# EAGLE design Polarshield v2.0c (EAGLE 6.5.0)
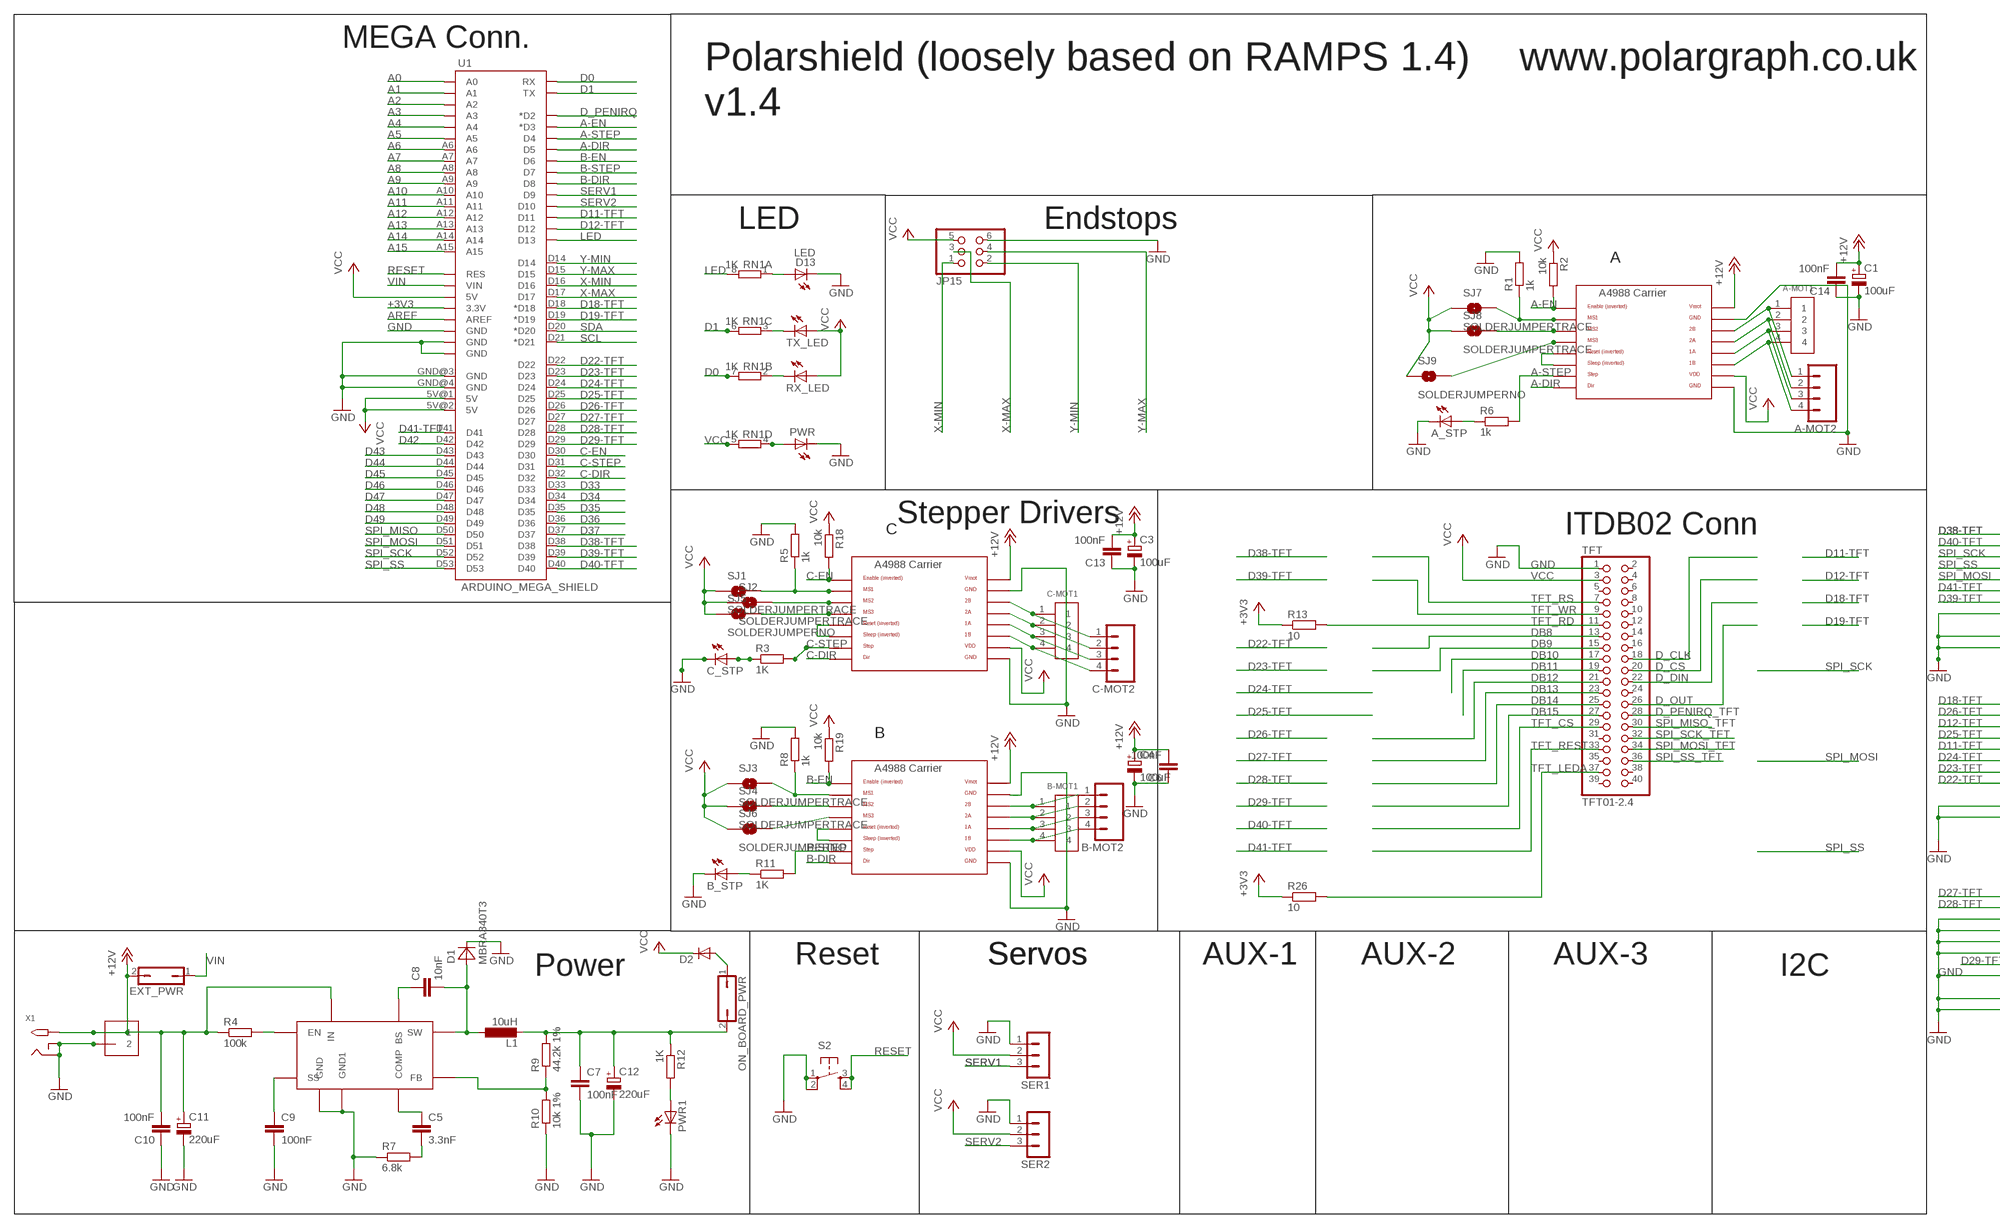
[diagram p0: schematic, sheet 1, part 1 of 2]
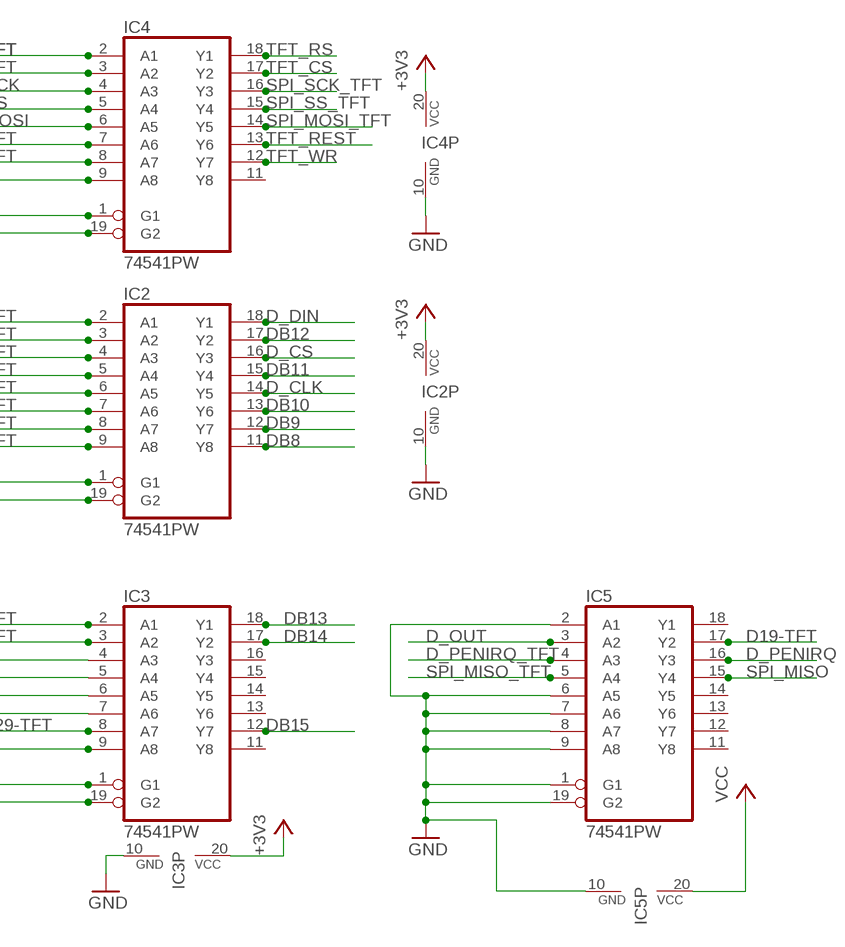
[diagram p1: schematic, sheet 1, part 2 of 2]

## Parts
A-MOT1  1X4-BIG  [1X04-BIG]
A-MOT2  M04SCREW  [SCREWTERMINAL-3.5MM-4]
A_STP  LEDCHIP-LED0805  [CHIP-LED0805]
B-MOT1  1X4-BIG  [1X04-BIG]
B-MOT2  M04SCREW  [SCREWTERMINAL-3.5MM-4]
B_STP  LEDCHIP-LED0805  [CHIP-LED0805]
C1  100uF  CPOL-EU153CLV-0605  [153CLV-0605]
C3  100uF  CPOL-EU153CLV-0605  [153CLV-0605]
C4  100uF  CPOL-EU153CLV-0605  [153CLV-0605]
C5  3.3nF  C-EUC0805K  [C0805K]
C6  100nF  C-EUC0805  [C0805]
C7  100nF  C-EUC0805K  [C0805K]
C8  10nF  C-EUC0805K  [C0805K]
C9  100nF  C-EUC0805K  [C0805K]
C10  100nF  C-EUC0805K  [C0805K]
C11  220uF  CPOL-EU153CLV-0807  [153CLV-0807]
C12  220uF  CPOL-EU153CLV-0807  [153CLV-0807]
C13  100nF  C-EUC0805  [C0805]
C14  100nF  C-EUC0805  [C0805]
C-MOT1  1X4-BIG  [1X04-BIG]
C-MOT2  M04SCREW  [SCREWTERMINAL-3.5MM-4]
C_STP  LEDCHIP-LED0805  [CHIP-LED0805]
D1  MBRA340T3  [SMA]
D2  DIODE-DO214BA  [DO214BA]
D13  LED  LEDCHIP-LED0805  [CHIP-LED0805]
EXT_PWR  JP1Q  [JP1]
IC1  MP2307  [SOIC8]
IC2  74541PW  [TSSOP20]
IC3  74541PW  [TSSOP20]
IC4  74541PW  [TSSOP20]
IC5  74541PW  [TSSOP20]
J1  1X2-3.5MM  [1X2-3.5MM]
JP15  PINHD-2X3  [2X03]
L1  10uH  L-EUPIS2816  [PIS2816]
ON_BOARD_PWR  JP1Q  [JP1]
PWR  LEDCHIP-LED0805  [CHIP-LED0805]
PWR1  LEDCHIP-LED0805  [CHIP-LED0805]
R1  1k  R-EU_R0805  [R0805]
R2  10k  R-EU_R0805  [R0805]
R3  1K  R-EU_R0805  [R0805]
R4  100k  R-EU_R0805  [R0805]
R5  1k  R-EU_R0805  [R0805]
R6  1k  R-EU_R0805  [R0805]
R7  6.8k  R-EU_R0805  [R0805]
R8  1k  R-EU_R0805  [R0805]
R9  44.2k 1%  R-EU_R0805  [R0805]
R10  10k 1%  R-EU_R0805  [R0805]
R11  1K  R-EU_R0805  [R0805]
R12  1K  R-EU_R0805  [R0805]
R13  10  R-EU_R0805  [R0805]
R18  10k  R-EU_R0805  [R0805]
R19  10k  R-EU_R0805  [R0805]
R26  10  R-EU_R0805  [R0805]
RN1  1K  4R-NEXBS8V  [EXBS8V]
RX_LED  LEDCHIP-LED0805  [CHIP-LED0805]
S2  TAC_SWITCHPTH  [TACTILE-PTH]
SER1  3PIN-HEADER  [3PIN-HEADER]
SER2  3PIN-HEADER  [3PIN-HEADER]
SJ1  SOLDERJUMPERTRACE  [SJ_2S-TRACE]
SJ2  SOLDERJUMPERTRACE  [SJ_2S-TRACE]
SJ3  SOLDERJUMPERTRACE  [SJ_2S-TRACE]
SJ4  SOLDERJUMPERTRACE  [SJ_2S-TRACE]
SJ5  SOLDERJUMPERNO  [SJ_2S-NO]
SJ6  SOLDERJUMPERNO  [SJ_2S-NO]
SJ7  SOLDERJUMPERTRACE  [SJ_2S-TRACE]
SJ8  SOLDERJUMPERTRACE  [SJ_2S-TRACE]
SJ9  SOLDERJUMPERNO  [SJ_2S-NO]
TFT  TFT01-2.4  [TFT01-2.4]
TX_LED  LEDCHIP-LED0805  [CHIP-LED0805]
U1  ARDUINO_MEGA_SHIELD  [ARDUINO_MEGA_SHIELD]
U$1  A4988BREAKOUT  [A4988BREAKOUT]
U$6  A4988BREAKOUT  [A4988BREAKOUT]
U$7  A4988BREAKOUT  [A4988BREAKOUT]
X1  2.1MMJACKTHM  [PJ-102A]

## Nets
+3V3: IC2.20(VCC) IC3.20(VCC) IC4.20(VCC) R13.1 R26.1 U1.3.3V
+12V [vmot]: C1.+ C3.+ C4.+ C6.2 C10.2 C11.+ C13.2 C14.2 EXT_PWR.2 IC1.IN J1.1 R4.1 U$1.VMOT U$6.VMOT U$7.VMOT X1.TIP
A0: U1.A0
A1: U1.A1
A2: U1.A2
A3: U1.A3
A4: U1.A4
A5: U1.A5
A6: U1.A6
A7: U1.A7
A8: U1.A8
A9: U1.A9
A10: U1.A10
A11: U1.A11
A12: U1.A12
A13: U1.A13
A14: U1.A14
A15: U1.A15
A-DIR: U1.D5 U$1.DIR
A-EN: R2.2 U1.D3(*D3) U$1.EN
A-STEP: R6.2 U1.D4 U$1.STEP
AREF: U1.AREF
B-DIR: U1.D8 U$7.DIR
B-EN: R19.2 U1.D6 U$7.EN
B-STEP: R11.2 U1.D7 U$7.STEP
C-DIR: U1.D32 U$6.DIR
C-EN: R18.2 U1.D30 U$6.EN
C-STEP: R3.2 U1.D31 U$6.STEP
D0: RN1.7 U1.RX
D1: RN1.6 U1.TX
D11-TFT: IC2.6(A5) U1.D11
D12-TFT: IC2.4(A3) U1.D12
D18-TFT: IC2.2(A1) U1.D18(*D18)
D19-TFT [signal]: IC5.17(Y2) U1.D19(*D19)
D22-TFT: IC2.9(A8) U1.D22
D23-TFT: IC2.8(A7) U1.D23
D24-TFT: IC2.7(A6) U1.D24
D25-TFT: IC2.5(A4) U1.D25
D26-TFT: IC2.3(A2) U1.D26
D27-TFT: IC3.2(A1) U1.D27
D28-TFT: IC3.3(A2) U1.D28
D29-TFT: IC3.8(A7) U1.D29
D33: U1.D33
D34: U1.D34
D35: U1.D35
D36: U1.D36
D37: U1.D37
D38-TFT: IC4.2(A1) U1.D38
D39-TFT: IC4.8(A7) U1.D39
D40-TFT: IC4.3(A2) U1.D40
D41-TFT: IC4.7(A6) U1.D41
D42: U1.D42
D43: U1.D43
D44: U1.D44
D45: U1.D45
D46: U1.D46
D47: U1.D47
D48: U1.D48
D49: U1.D49
D_CLK: IC2.14(Y5) TFT.18
D_CS: IC2.16(Y3) TFT.20
D_DIN: IC2.18(Y1) TFT.22
D_OUT: IC5.3(A2) TFT.26
D_PENIRQ: IC5.16(Y3) U1.D2(*D2)
D_PENIRQ_TFT: IC5.4(A3) TFT.28
DB8: IC2.11(Y8) TFT.13
DB9: IC2.12(Y7) TFT.15
DB10: IC2.13(Y6) TFT.17
DB11: IC2.15(Y4) TFT.19
DB12: IC2.17(Y2) TFT.21
DB13: IC3.18(Y1) TFT.23
DB14: IC3.17(Y2) TFT.25
DB15: IC3.12(Y7) TFT.27
GND [gnd5]: A_STP.C B_STP.C C1.- C3.- C4.- C6.1 C7.2 C9.2 C10.1 C11.- C12.- C13.1 C14.1 C_STP.C D1.C D13.C IC1.GND IC1.GND1 IC2.1(G1) IC2.10(GND) IC2.19(G2) IC3.1(G1) IC3.4(A3) IC3.5(A4) IC3.6(A5) IC3.7(A6) IC3.9(A8) IC3.10(GND) IC3.19(G2) IC4.1(G1) IC4.9(A8) IC4.10(GND) IC4.19(G2) IC5.1(G1) IC5.2(A1) IC5.6(A5) IC5.7(A6) IC5.8(A7) IC5.9(A8) IC5.10(GND) IC5.19(G2) J1.2 JP15.6 PWR1.C PWR.C R1.2 R5.2 R7.1 R8.2 R10.1 S2.1 S2.2 SER1.1 SER2.1 TFT.1 U1.GND@0(GND) U1.GND@1(GND) U1.GND@2(GND) U1.GND@3(GND) U1.GND@4(GND) U$1.GND U$1.GND@0(GND) U$6.GND U$6.GND@0(GND) U$7.GND U$7.GND@0(GND) X1.RING X1.RING_SW
LED: RN1.8 U1.D13
N$1: U$6.RST U$6.SLP(SLEEP)
N$2: PWR.A RN1.4
N$3: R5.1 SJ1.2 U$6.MS1
N$4: A-MOT1.1 A-MOT2.1 U$1.2B
N$5 [vmot]: A-MOT1.2 A-MOT2.2 U$1.2A
N$6 [vmot]: A-MOT1.3 A-MOT2.3 U$1.1A
N$7: A-MOT1.4 A-MOT2.4 U$1.1B
N$8: U$1.RST U$1.SLP(SLEEP)
N$9: R1.1 SJ7.2 U$1.MS1
N$10: SJ2.2 U$6.MS2
N$11: SJ8.2 U$1.MS2
N$12: SJ5.2 U$6.MS3
N$13: U$7.RST U$7.SLP(SLEEP)
N$14: SJ9.2 U$1.MS3
N$15: RN1.2 RX_LED.C
N$16: RN1.3 TX_LED.C
N$17: SJ4.2 U$7.MS2
N$18: B_STP.A R11.1
N$19: A_STP.A R6.1
N$20: D13.A RN1.1
N$21: C-MOT1.1 C-MOT2.1 U$6.2B
N$22: C-MOT1.2 C-MOT2.2 U$6.2A
N$23: C_STP.A R3.1
N$24: C7.1 C12.+ L1.2 ON_BOARD_PWR.2 R9.2 R12.1
N$25: PWR1.A R12.2
N$26: C-MOT1.3 C-MOT2.3 U$6.1A
N$27: C-MOT1.4 C-MOT2.4 U$6.1B
N$28: B-MOT1.1 B-MOT2.1 U$7.2B
N$29: B-MOT1.2 B-MOT2.2 U$7.2A
N$30: B-MOT1.3 B-MOT2.3 U$7.1A
N$31: SJ6.2 U$7.MS3
N$32: IC1.FB R9.1 R10.2
N$33: R8.1 SJ3.2 U$7.MS1
N$34: IC1.EN R4.2
N$36: B-MOT1.4 B-MOT2.4 U$7.1B
N$37: D2.A ON_BOARD_PWR.1
N$38: C9.1 IC1.SS
N$40: C5.2 R7.2
N$42: C5.1 IC1.COMP
N$43: C8.1 IC1.BS
N$44: C8.2 D1.A IC1.SW L1.1
RESET: S2.3 S2.4 U1.RES
SCL: U1.D21(*D21)
SDA: U1.D20(*D20)
SERV1: SER1.3 U1.D9
SERV2: SER2.3 U1.D10
SPI_MISO: IC5.15(Y4) U1.D50
SPI_MISO_TFT: IC5.5(A4) TFT.30
SPI_MOSI: IC4.6(A5) U1.D51
SPI_MOSI_TFT: IC4.14(Y5) TFT.34
SPI_SCK: IC4.4(A3) U1.D52
SPI_SCK_TFT: IC4.16(Y3) TFT.32
SPI_SS: IC4.5(A4) U1.D53
SPI_SS_TFT: IC4.15(Y4) TFT.36
TFT_CS: IC4.17(Y2) TFT.29
TFT_LEDA: R26.2 TFT.37
TFT_RD: R13.2 TFT.11
TFT_REST: IC4.13(Y6) TFT.33
TFT_RS: IC4.18(Y1) TFT.7
TFT_WR: IC4.12(Y7) TFT.9
VCC: D2.C IC5.20(VCC) JP15.5 R2.1 R18.1 R19.1 RN1.5 RX_LED.A SER1.2 SER2.2 SJ1.1 SJ2.1 SJ3.1 SJ4.1 SJ5.1 SJ6.1 SJ7.1 SJ8.1 SJ9.1 TFT.3 TX_LED.A U1.5V@0(5V) U1.5V@1(5V) U1.5V@2(5V) U$1.VDD U$6.VDD U$7.VDD
VIN [vcc]: EXT_PWR.1 U1.VIN
X-MAX: JP15.3 U1.D17
X-MIN: JP15.1 U1.D16
Y-MAX: JP15.4 U1.D15
Y-MIN: JP15.2 U1.D14
Unconnected: IC3.11(Y8) IC3.13(Y6) IC3.14(Y5) IC3.15(Y4) IC3.16(Y3) IC4.11(Y8) IC5.11(Y8) IC5.12(Y7) IC5.13(Y6) IC5.14(Y5) IC5.18(Y1) TFT.2 TFT.4 TFT.5 TFT.6 TFT.8 TFT.10 TFT.12 TFT.14 TFT.16 TFT.24 TFT.31 TFT.35 TFT.38 TFT.39 TFT.40

## Notes on the sheet
- MEGA Conn.
- Polarshield (loosely based on RAMPS 1.4) | www.polargraph.co.uk
- v1.4
- LED | Endstops
- A
- Stepper Drivers
- C | ITDB02 Conn
- B
- Reset | Servos | Servos | AUX-1 | AUX-2 | AUX-3
- Power | I2C

## Library data of the parts
A-MOT1 B-MOT1 C-MOT1 = adafruit:1X4: 4-pin connector
A-MOT2 B-MOT2 C-MOT2 = SparkFun:M04: Header 4 Standard 4-pin 0.1" header. Use with straight break away headers (SKU : PRT-00116), right angle break away headers (PRT-00553), swiss pins (PRT-00743), machine pins (PRT-00117), and female headers (PRT-00115). Molex polarized connector foot print use with SKU : PRT-08231 with associated crimp pins and housings. 1MM SMD Version SKU: PRT-10208
A_STP B_STP C_STP D13 PWR PWR1 RX_LED TX_LED = led:LED: LED OSRAM: - CHIPLED LG R971, LG N971, LY N971, LG Q971, LY Q971, LO R971, LY R971 LH N974, LH R974 LS Q976, LO Q976, LY Q976 LO Q996 - Hyper CHIPLED LW Q18S LB Q993, LB Q99A, LB R99A - SideLED LS A670, LO A670, LY A670, LG A670, LP A670 LB A673, LV A673, LT A673, LW A673 LH A674 LY A675 LS A676, LA A676, LO A676, LY A676, LW A676 LS A679, LY A679, LG A679 - Hyper Micro SIDELED® LS Y876, LA Y876, LO Y876, LY Y876 LT Y87S - SmartLED LW L88C, LW L88S LB L89C, LB L89S, LG L890 LS L89K, LO L89K, LY L89K LS L896, LA L896, LO L896, LY L896 - TOPLED LS T670, LO T670, LY T670, LG T670, LP T670 LSG T670, LSP T670, LSY T670, LOP T670, LYG T670 LG T671, LOG T671, LSG T671 LB T673, LV T673, LT T673, LW T673 LH T674 LS T676, LA T676, LO T676, LY T676, LB T676, LH T676, LSB T676, LW T676 LB T67C, LV T67C, LT T67C, LS T67K, LO T67K, LY T67K, LW E67C LS E67B, LA E67B, LO E67B, LY E67B, LB E67C, LV E67C, LT E67C LW T67C LS T679, LY T679, LG T679 LS T770, LO T770, LY T770, LG T770, LP T770 LB T773, LV T773, LT T773, LW T773 LH T774 LS E675, LA E675, LY E675, LS T675 LS T776, LA T776, LO T776, LY T776, LB T776 LHGB T686 LT T68C, LB T68C - Hyper Mini TOPLED® LB M676 - Mini TOPLED Santana® LG M470 LS M47K, LO M47K, LY M47K Source: http://www.osram.convergy.de LUXEON: - LUMILED® LXK2-PW12-R00, LXK2-PW12-S00, LXK2-PW14-U00, LXK2-PW14-V00 LXK2-PM12-R00, LXK2-PM12-S00, LXK2-PM14-U00 LXK2-PE12-Q00, LXK2-PE12-R00, LXK2-PE12-S00, LXK2-PE14-T00, LXK2-PE14-U00 LXK2-PB12-K00, LXK2-PB12-L00, LXK2-PB12-M00, LXK2-PB14-N00, LXK2-PB14-P00, LXK2-PB14-Q00 LXK2-PR12-L00, LXK2-PR12-M00, LXK2-PR14-Q00, LXK2-PR14-R00 LXK2-PD12-Q00, LXK2-PD12-R00, LXK2-PD12-S00 LXK2-PH12-R00, LXK2-PH12-S00 LXK2-PL12-P00, LXK2-PL12-Q00, LXK2-PL12-R00 Source: www.luxeon.com KINGBRIGHT: KA-3528ASYC Source: www.kingbright.com
C1 C3 C4 = rcl:CPOL-EU: POLARIZED CAPACITOR, European symbol
C5-C10 C13 C14 = resistor:C-EU: CAPACITOR, European symbol
C11 C12 = resistor:CPOL-EU: POLARIZED CAPACITOR, European symbol
D1 = diode:MBRA340T3: Surface Mount Schottky Power Rectifier Source: http://www.onsemi.com/pub_link/Collateral/MBRA340T3-D.PDF
D2 = diode:DIODE-: DIODE
EXT_PWR ON_BOARD_PWR = jumper:JP1Q: JUMPER
IC1 = sandy:MP2307
IC2-IC5 = 74xx-eu:74*541: Octal BUFFER and LINE DRIVER, 3-state
J1 = adafruit:1X2: 3.5mm Terminal block http://www.ladyada.net/library/pcb/eaglelibrary.html
JP15 = pinhead:PINHD-2X3: PIN HEADER
L1 = rcl:L-EU: INDUCTOR, European symbol
R1-R3 R5 R6 R8 R11 R12 R18 R19 = rcl:R-EU_: RESISTOR, European symbol
R4 R7 R9 R10 R13 R26 = resistor:R-EU_: RESISTOR, European symbol
RN1 = resistor-dil:4R-N: Array Chip Resistor Source: RS Component / Phycomp; OC_FARNELL: unknown; OC_NEWARK: unknown
S2 = SparkFun:TAC_SWITCH: Momentary Switch Button commonly used for reset or general input. Spark Fun Electronics SKU : COM-00097
SER1 SER2 = ultimachine:3PIN-HEADER: PIN HEADER
SJ1-SJ9 = SparkFun:SOLDERJUMPER: Solder Jumper Standard SMD solder jumper. Used to automate production. Two varients : Normally Open and Normally Closed are the same, but have different paste layers. NC will have a large amount of paste and should jumper during reflow.
TFT = sandy:TFT01-2.4
U1 = RepRapjr:ARDUINO_MEGA_SHIELD
U$1 U$6 U$7 = RepRapjr:A4988BREAKOUT
X1 = adafruit:2.1MMJACK: 2.1mm x 5.5mm THM DC jack with internal switch. Digikey part #PJ-102A, 4UCON part #05537 2.1mm x 5.5mm SMT DC jack with internal switch. Digikey part #PJ-002A-SMT, 4UCON part #03267 By microbuilder.eu & adafruit.com

## Net classes
0 default: width 0.406 mm
1 gnd12: width 1.422 mm
2 gnd5: width 1.422 mm
3 vmot: width 1.422 mm
4 vcc: width 0.61 mm
5 signal: width 0.406 mm

## Board
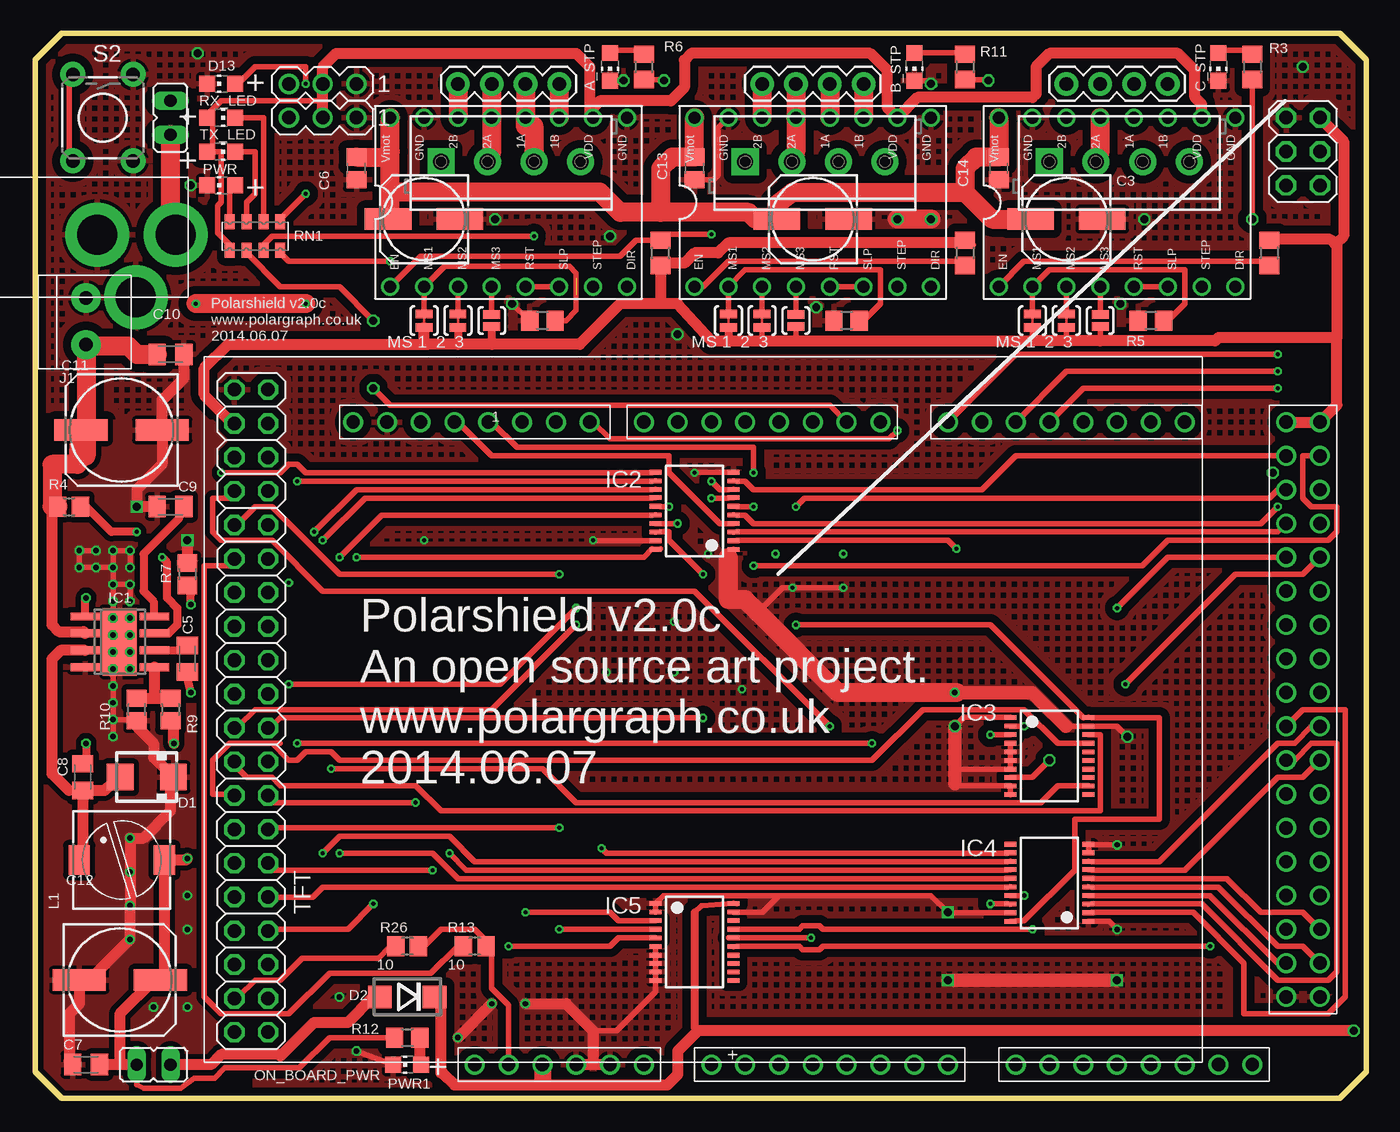
[diagram p2: board, top side]
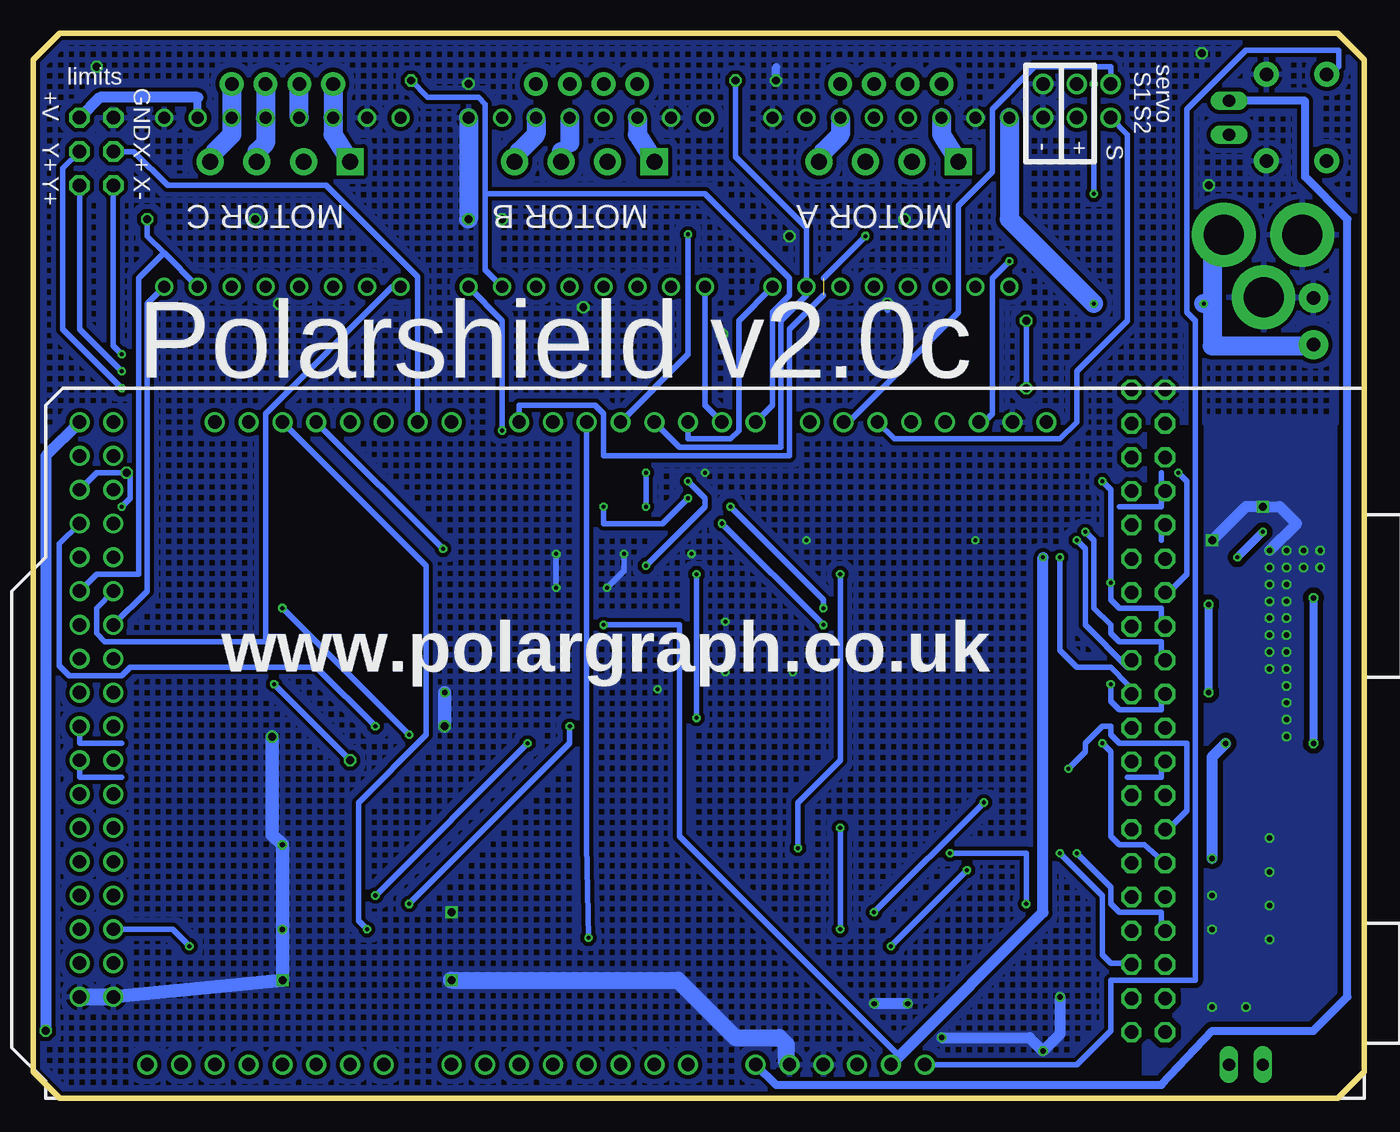
[diagram p3: board, bottom side, seen from below]

Size 100 x 80 mm. Coordinates in mm from the lower left corner, seen from the top.
Outline: 100,2 100,78 98,80 2,80 0,78 0,2 2,0 98,0 100,2
Copper layers (1*2*15*16): Top 0.035mm / dielectric 0.2mm / Route2 0.0175mm / dielectric 1.1mm / Route15 0.0175mm / dielectric 0.2mm / Bottom 0.035mm
Design rules "SeeedStudio_DRU_no_angle_20130527": minimum track width 6mil, minimum drill 12mil, track to track 6mil, track to pad 6mil, pad to pad 6mil, via to via 6mil, smd to smd 0mil, copper to edge 10mil, drill to drill 10mil, minimum pad ring 6mil, minimum via ring 6mil, stop-mask expansion 2mil, vias tented up to drill 25mil, thermal gap 10mil

### Footprints (pad centres in the part's own frame; a part is rotated, then mirrored left to right if it is on the bottom)
1X04-BIG = drill 1.016 pad 1.778: 1 0,0; 2 2.54,0; 3 5.08,0; 4 7.62,0
SCREWTERMINAL-3.5MM-4 = drill 1.2 pad 2.032 square: 1 0,0 | drill 1.2 pad 2.032: 2 3.5,0; 3 7,0; 4 10.5,0
CHIP-LED0805 = smd 1.2 x 1.2: A 0,-1.05; C 0,1.05
153CLV-0605 = smd 3.5 x 1.6: + 2.7,0; - -2.7,0
C0805K = smd 1.3 x 1.6: 1 -1,0; 2 1,0
C0805 = smd 1.3 x 1.5: 1 -0.85,0; 2 0.85,0
153CLV-0807 = smd 4 x 1.6: + 3.05,0; - -3.05,0
SMA = smd 2 x 2: A 2,0; C -2,0
DO214BA = smd 1.8 x 1.7: A 2.05,0; C -2.05,0
JP1 = drill 0.914 long: 1 0,-1.27; 2 0,1.27
SOIC8 = smd 0.6 x 2.2: BS -1.905,-2.6; COMP 0.635,2.6; EN -0.635,2.6; FB 1.905,2.6; GND 1.905,-2.6; IN -0.635,-2.6; SS -1.905,2.6; SW 0.635,-2.6 | smd 5.08 x 2.54: GND1 0,0
TSSOP20 = smd 0.35 x 0.9: 1 -1.95,-2.925; 2 -1.3,-2.925; 3 -0.65,-2.925; 4 0,-2.925; 5 0.65,-2.925; 6 1.3,-2.925; 7 1.95,-2.925; 8 2.555,-2.925; 9 3.205,-2.925; 10 3.855,-2.925; 11 3.855,2.925; 12 3.205,2.925; 13 2.555,2.925; 14 1.95,2.925; 15 1.3,2.925; 16 0.65,2.925; 17 0,2.925; 18 -0.65,2.925; 19 -1.3,2.925; 20 -1.95,2.925
1X2-3.5MM = drill 1 pad 2.184: 1 1.8,0; 2 -1.7,0
2X03 = drill 1.016 octagon: 1 -2.54,-1.27; 2 -2.54,1.27; 3 0,-1.27; 4 0,1.27; 5 2.54,-1.27; 6 2.54,1.27
PIS2816 = smd 2.2 x 1.6: 1 0,3.2; 2 0,-3.2
R0805 = smd 1.3 x 1.5: 1 -0.95,0; 2 0.95,0
R0805' = smd 1.3 x 1.5: 1 -0.85,0; 2 0.85,0
EXBS8V = smd 0.75 x 1.1: 1 -1.905,-1.07; 2 -0.635,-1.07; 3 0.635,-1.07; 4 1.905,-1.07; 5 1.905,1.07; 6 0.635,1.07; 7 -0.635,1.07; 8 -1.905,1.07
TACTILE-PTH = drill 1.016 pad 1.88: 1 -3.251,2.261; 2 3.251,2.261; 3 -3.251,-2.261; 4 3.251,-2.261
3PIN-HEADER = drill 1.016: 1 -2.54,0; 2 0,0; 3 2.54,0
SJ_2S-TRACE = smd 0.635 x 1.27: 1 -0.508,0; 2 0.508,0
SJ_2S-NO = smd 0.635 x 1.27: 1 -0.45,0; 2 0.45,0
TFT01-2.4 = drill 1.016 octagon: 1 0.98,24.02; 2 3.52,24.02; 3 0.98,21.48; 4 3.52,21.48; 5 0.98,18.94; 6 3.52,18.94; 7 0.98,16.4; 8 3.52,16.4; 9 0.98,13.86; 10 3.52,13.86; 11 0.98,11.32; 12 3.52,11.32; 13 0.98,8.78; 14 3.52,8.78; 15 0.98,6.24; 16 3.52,6.24; 17 0.98,3.7; 18 3.52,3.7; 19 0.98,1.16; 20 3.52,1.16; 21 0.98,-1.38; 22 3.52,-1.38; 23 0.98,-3.92; 24 3.52,-3.92; 25 0.98,-6.46; 26 3.52,-6.46; 27 0.98,-9; 28 3.52,-9; 29 0.98,-11.54; 30 3.52,-11.54; 31 0.98,-14.08; 32 3.52,-14.08; 33 0.98,-16.62; 34 3.52,-16.62; 35 0.98,-19.16; 36 3.52,-19.16; 37 0.98,-21.7; 38 3.52,-21.7; 39 0.98,-24.24; 40 3.52,-24.24
ARDUINO_MEGA_SHIELD = drill 1 pad 1.422: 3.3V 50.8,26.67; 5V@0 50.8,29.21; 5V@1 2.54,85.09; 5V@2 2.54,87.63; A0 50.8,41.91; A1 50.8,44.45; A2 50.8,46.99; A3 50.8,49.53; A4 50.8,52.07; A5 50.8,54.61; A6 50.8,57.15; A7 50.8,59.69; A8 50.8,64.77; A9 50.8,67.31; A10 50.8,69.85; A11 50.8,72.39; A12 50.8,74.93; A13 50.8,77.47; A14 50.8,80.01; A15 50.8,82.55; AREF 2.54,14.986; D2 2.54,49.53; D3 2.54,46.99; D4 2.54,44.45; D5 2.54,41.91; D6 2.54,39.37; D7 2.54,36.83; D8 2.54,32.766; D9 2.54,30.226; D10 2.54,27.686; D11 2.54,25.146; D12 2.54,22.606; D13 2.54,20.066; D14 2.54,59.69; D15 2.54,62.23; D16 2.54,64.77; D17 2.54,67.31; D18 2.54,69.85; D19 2.54,72.39; D20 2.54,74.93; D21 2.54,77.47; D22 5.08,85.09; D23 5.08,87.63; D24 7.62,85.09; D25 7.62,87.63; D26 10.16,85.09; D27 10.16,87.63; D28 12.7,85.09; D29 12.7,87.63; D30 15.24,85.09; D31 15.24,87.63; D32 17.78,85.09; D33 17.78,87.63; D34 20.32,85.09; D35 20.32,87.63; D36 22.86,85.09; D37 22.86,87.63; D38 25.4,85.09; D39 25.4,87.63; D40 27.94,85.09; D41 27.94,87.63; D42 30.48,85.09; D43 30.48,87.63; D44 33.02,85.09; D45 33.02,87.63; D46 35.56,85.09; D47 35.56,87.63; D48 38.1,85.09; D49 38.1,87.63; D50 40.64,85.09; D51 40.64,87.63; D52 43.18,85.09; D53 43.18,87.63; GND@0 50.8,31.75; GND@1 50.8,34.29; GND@2 2.54,17.526; GND@3 45.72,85.09; GND@4 45.72,87.63; RES 50.8,24.13; RX 2.54,54.61; TX 2.54,52.07; VIN 50.8,36.83
A4988BREAKOUT = drill 0.9: 1A 8.89,1.27; 1B 11.43,1.27; 2A 6.35,1.27; 2B 3.81,1.27; DIR 16.51,-11.43; EN -1.27,-11.43; GND 16.51,1.27; GND@0 1.27,1.27; MS1 1.27,-11.43; MS2 3.81,-11.43; MS3 6.35,-11.43; RST 8.89,-11.43; SLP 11.43,-11.43; STEP 13.97,-11.43; VDD 13.97,1.27; VMOT -1.27,1.27
PJ-102A = drill 3 pad 4.8: RING 0.1,-3.39; RING_SW -4.6,-6.29; TIP 0.1,-9.29

### Placement (x,y rotation side)
A-MOT1  31.75,76.2 0 top
A-MOT2  30.48,70.36 0 top
A_STP  43.18,77.47 180 top
B-MOT1  54.61,76.2 0 top
B-MOT2  53.34,70.36 0 top
B_STP  66.04,77.47 180 top
C1  29.21,66.04 180 top
C3  77.47,66.04 180 top
C4  58.42,66.04 180 top
C5  11.43,33.02 270 top
C6  24.13,69.85 90 top
C7  3.81,2.54 180 top
C8  3.56,24.13 270 top
C9  10.16,44.45 180 top
C10  10.16,55.88 180 top
C11  6.48,50.2 180 top
C12  6.35,8.89 0 top
C13  49.53,69.85 90 top
C14  72.39,69.85 90 top
C-MOT1  77.47,76.2 0 top
C-MOT2  76.2,70.36 0 top
C_STP  88.9,77.47 180 top
D1  8.38,24.13 180 top
D2  27.94,7.62 180 top
D13  13.97,76.2 90 top
EXT_PWR  10.16,73.66 180 top
IC1  6.35,34.29 270 top
IC2  49.53,43.18 90 top
IC3  76.2,26.67 270 top
IC4  76.2,15.24 90 top
IC5  49.53,12.7 270 top
J1  3.81,58.42 270 top
JP15  95.25,71.12 90 top
L1  6.5,17.91 90 top
ON_BOARD_PWR  8.89,2.54 90 top
PWR  13.97,68.58 90 top
PWR1  27.94,2.54 90 top
R1  38.1,58.42 180 top
R2  46.99,63.5 90 top
R3  91.44,77.47 270 top
R4  100k  [R0805']  2.54,44.45 0 top
R5  83.82,58.42 180 top
R6  45.72,77.47 270 top
R7  6.8k  [R0805']  11.43,39.37 270 top
R8  60.96,58.42 180 top
R9  44.2k 1%  [R0805']  10.16,29.21 270 top
R10  10k 1%  [R0805']  7.62,29.21 90 top
R11  69.85,77.47 270 top
R12  27.94,4.57 0 top
R13  10  [R0805']  33.02,11.43 180 top
R18  92.71,63.5 270 top
R19  69.85,63.5 270 top
R26  10  [R0805']  27.94,11.43 180 top
RN1  16.51,64.77 180 top
RX_LED  13.97,73.66 270 top
S2  5.08,73.66 270 top
SER1  21.59,76.2 180 top
SER2  21.59,73.66 180 top
SJ1  74.93,58.42 90 top
SJ2  77.47,58.42 90 top
SJ3  52.07,58.42 90 top
SJ4  54.61,58.42 90 top
SJ5  80.01,58.42 90 top
SJ6  57.15,58.42 90 top
SJ7  29.21,58.42 90 top
SJ8  31.75,58.42 90 top
SJ9  34.29,58.42 90 top
TFT  13.97,29.21 0 top
TX_LED  13.97,71.12 270 top
U1  8.89,53.34 270 top
U$1  27.94,72.39 0 top
U$6  73.66,72.39 0 top
U$7  50.8,72.39 0 top
X1  1.27,64.77 90 top

### Tracks (layer width: path | path; a pad name or v marks a point on that pad's centre or on a via)
+3V3  (via drill 0.3)
  Top 0.406: IC4.20 73.66,13.34 74.3,13.34 78.11,17.14 78.11,20.95 84.45,20.95 84.45,28.57 79.38,28.57 IC3.20 78.74,28.57 71.75,35.56 v57.15,35.56 | 34.29,11.43 33.02,12.7 30.48,12.7 29.21,11.43 R26.1 | 46.99,41.27 IC2.20 46.35,41.27 45.72,40.64 v24.13,40.64 | 34.29,11.43 34.29,8.26 35.56,6.99 U1.3.3V | 34.29,11.43 R13.1
  Bottom 0.406: v57.15,35.56 51.44,35.56 51.44,19.68 34.92,3.17
  Bottom 0.813: v24.13,40.64 24.13,13.97 34.92,3.17 U1.3.3V
+12V  (via drill 0.3)
  Top 0.813: IC1.IN 3.62,35.05 1.78,35.05 1.27,35.56 1.27,44.03 R4.1
  Top 1.422: R4.1 1.27,44.45 1.27,47.62 3.17,47.62 C11.+ 3.81,48.26 J1.1 3.81,56.52 6.99,56.52 7.62,55.88 C10.2 | EXT_PWR.2 10.16,65.41 X1.TIP | 26.67,68.07 26.67,66.04 C1.+ | 26.67,68.07 26.67,71.12 | 26.67,71.12 U$1.VMOT | 46.99,66.55 53.59,66.55 54.1,66.04 C4.+ 55.72,67.15 56.9,68.07 69.85,68.07 | 46.99,66.55 43.94,66.55 42.42,68.07 26.67,68.07 | v20.32,59.69 v12.06,59.69 | C6.2 26.25,70.7 26.67,71.12 | U$7.VMOT C13.2 47.84,70.7 46.99,69.85 46.99,66.55 | U$6.VMOT C14.2 70.7,70.7 69.85,69.85 69.85,68.07 | 69.85,68.07 71.88,66.04 C3.+
  Bottom 1.422: 11.43,59.69 11.43,64.14 10.79,64.77 X1.TIP | 11.43,59.69 11.43,56.52 3.81,56.52 J1.1 | v20.32,59.69 26.67,66.04 U$1.VMOT | v12.06,59.69 11.43,59.69
A-DIR
  Bottom 0.406: U$1.DIR 46.99,58.42 46.99,50.16 47.62,49.53 50.8,49.53 U1.D5
A-EN  (via drill 0.3)
  Top 0.406: U$1.EN 28.96,63.25 43.94,63.25 45.15,64.45 R2.2 47.44,64.9 v50.8,64.9
  Bottom 0.406: U1.D3 50.8,55.88 v50.8,64.9
A-STEP  (via drill 0.6)
  Top 0.406: R6.2 47.18,76.52 v47.24,76.45
  Bottom 0.406: U1.D4 51.44,48.9 43.81,48.9 43.81,58.42 41.91,60.33 U$1.STEP 41.91,65.41 47.24,70.74 v47.24,76.45
B-DIR  (via drill 0.3)
  Top 0.406: v64.77,50.16 64.14,49.53 43.18,49.53 41.91,50.8 U1.D8
  Bottom 0.406: U$7.DIR 64.77,58.42 v64.77,50.16
B-EN
  Top 0.406: U$7.EN 50.16,60.96 52.07,62.87 69.85,62.87 R19.2
  Bottom 0.406: U1.D6 49.53,52.07 U$7.EN
B-STEP  (via drill 0.6)
  Top 0.406: R11.2 71.56,76.52 v71.63,76.45
  Bottom 0.406: 66.04,67.94 66.04,62.23 U$7.STEP | 66.04,67.94 66.04,74.68 66.55,75.18 70.36,75.18 v71.63,76.45 | U1.D7 44.45,52.07 44.45,59.05 43.18,60.33 43.18,61.59 49.53,67.94 66.04,67.94
C-DIR
  Bottom 0.406: U$6.DIR 91.44,59.69 91.44,38.1 U1.D32
C-EN
  Top 0.406: U$6.EN 74.3,62.87 92.71,62.87 R18.2
  Bottom 0.406: U1.D30 95.25,36.83 95.25,34.92 94.61,34.29 82.55,34.29 82.55,51.44 73.03,60.96 U$6.EN
C-STEP  (via drill 0.6)
  Top 0.406: v91.44,66.04 R3.2
  Bottom 0.406: U$6.STEP 90.17,63.5 | 90.17,63.5 91.44,64.77 v91.44,66.04 | U1.D31 95.25,39.37 92.08,39.37 92.08,61.59 90.17,63.5
D0  (via drill 0.3)  (1 unrouted)
  Top 0.406: v37.47,64.77 17.78,64.77 17.14,64.14 RN1.7
  Bottom 0.406: 40.64,61.59 v37.47,64.77 | 40.64,60.33 43.18,57.78 43.18,48.26 57.15,48.26 57.15,51.44 57.78,52.07 63.5,52.07 U1.RX
D1  (via drill 0.6)
  Top 0.406: U1.TX 59.69,52.07 26.67,52.07 v25.4,53.34 | RN1.6 15.88,63.5 18.41,60.96 22.86,60.96 v25.4,58.42
  Bottom 0.406: v25.4,53.34 v25.4,58.42
D11-TFT  (via drill 0.3)
  Top 0.406: U1.D11 34.29,50.8 36.2,48.9 53.98,48.9 v53.98,46.99 | v53.98,44.45 52.7,44.45 IC2.6
  Bottom 0.406: v53.98,46.99 v53.98,44.45
D12-TFT
  Top 0.406: IC2.4 51.44,43.18 47.62,46.99 47.62,48.26 34.29,48.26 31.75,50.8 U1.D12
D18-TFT  (via drill 0.3)
  Top 0.406: v69.22,41.27 68.58,41.91 52.7,41.91 IC2.2
  Bottom 0.406: v69.22,41.27 U1.D18
D19-TFT  (via drill 0.3)
  Top 0.406: v74.93,12.7 59.18,12.7 58.93,12.95 57.66,12.95 57.4,12.7 IC5.17
  Bottom 0.406: v74.93,12.7 75.56,13.34 75.56,22.23 70.48,27.3 70.48,40.01 U1.D19
D22-TFT
  Top 0.406: U1.D22 73.66,48.26 71.12,45.72 53.98,45.72 53.34,46.35 52.7,46.35 IC2.9
D23-TFT  (via drill 0.3)
  Top 0.406: U1.D23 95.25,48.26 95.25,45.09 95.89,44.45 97.79,44.45 97.79,42.55 97.16,41.91 85.09,41.91 83.19,40.01 v53.98,40.01 | v50.8,46.35 51.44,45.72 52.07,45.72 IC2.8
  Bottom 0.406: v50.8,46.35 49.53,45.09 49.53,44.45 v53.98,40.01
D24-TFT  (via drill 0.3)
  Top 0.406: v50.8,45.09 52.07,45.09 IC2.7 | v57.15,44.45 57.78,45.09 92.71,45.09 93.34,45.72 U1.D24
  Bottom 0.406: v50.8,45.09 52.7,43.18 57.15,43.18 v57.15,44.45
D25-TFT  (via drill 0.3, 0.6)
  Top 0.406: v93.34,44.45 92.08,43.18 53.98,43.18 53.34,43.81 52.7,43.81 IC2.5
  Bottom 0.406: U1.D25 95.25,46.99 v92.96,46.99 92.71,46.99 92.71,45.09 v93.34,44.45
D26-TFT
  Top 0.406: U1.D26 93.34,42.55 52.7,42.55 IC2.3
D27-TFT  (via drill 0.3)
  Top 0.406: v74.3,27.94 73.66,27.94 IC3.2
  Bottom 0.406: v74.3,27.94 78.74,32.38 92.71,32.38 93.34,31.75 97.28,31.75 98.04,32.51 98.04,41.66 U1.D27
D28-TFT  (via drill 0.3)
  Top 0.406: v71.75,27.3 73.03,27.3 IC3.3 | v81.28,36.83 85.09,40.64 U1.D28
  Bottom 0.406: v81.28,36.83 v71.75,27.3
D29-TFT  (via drill 0.3, 0.6)
  Top 0.406: U1.D29 95.25,39.37 90.17,39.37 v81.92,31.11 | IC3.8 73.66,24.13 74.93,24.13 v76.2,25.4
  Bottom 0.406: v81.92,31.11 v76.2,25.4
D38-TFT
  Top 0.406: U1.D38 95.25,29.21 98.42,29.21 98.42,7.62 97.16,6.35 90.81,6.35 90.81,10.16 87,13.97 79.38,13.97 IC4.2
D39-TFT
  Top 0.406: U1.D39 95.89,27.94 94.61,26.67 93.34,26.67 84.45,17.78 79.38,17.78 IC4.8
  Bottom 0.406: 93.34,26.67 96.52,26.67 U1.D39
D40-TFT
  Top 0.406: U1.D40 94.61,25.4 95.89,26.67 97.79,26.67 97.79,9.53 97.16,8.89 93.34,8.89 87.63,14.61 79.38,14.61 IC4.3
D41-TFT
  Top 0.406: U1.D41 95.25,24.13 93.34,24.13 86.36,17.14 79.38,17.14 IC4.7
  Bottom 0.406: 93.34,24.13 96.52,24.13 U1.D41
D_CLK  (via drill 0.3)
  Top 0.406: v21.59,41.91 24.77,45.09 46.35,45.09 IC2.14
  Bottom 0.406: v21.59,41.91 20.95,41.27 20.95,35.56 17.78,32.38 TFT.18
D_CS  (via drill 0.3)
  Top 0.406: v22.86,40.64 26.04,43.81 46.35,43.81 IC2.16
  Bottom 0.406: 17.78,29.84 TFT.20 17.49,30.48 17.53,30.48 17.78,31.11 19.05,32.38 21.59,32.38 22.86,33.66 v22.86,40.64
D_DIN  (via drill 0.3)
  Top 0.406: TFT.22 17.78,27.94 18.41,28.57 v50.16,28.57 | v50.16,39.37 47.62,41.91 47.62,42.55 46.99,42.55 IC2.18
  Bottom 0.406: 17.78,27.3 TFT.22 | v50.16,39.37 v50.16,28.57
D_OUT  (via drill 0.3)
  Top 0.406: v36.83,13.97 43.18,13.97 43.81,13.34 46.35,13.34 IC5.3 | v28.57,22.23 17.78,22.23 TFT.26
  Bottom 0.406: 17.78,22.23 TFT.26 | v28.57,22.23 v36.83,13.97
D_PENIRQ  (via drill 0.3)
  Top 0.406: v58.29,12.06 52.07,12.06 IC5.16
  Bottom 0.406: v58.29,12.06 58.42,19.05 U1.D2
D_PENIRQ_TFT  (via drill 0.3)
  Top 0.406: v39.37,12.7 IC5.4 | v39.37,20.32 17.78,20.32 TFT.28
  Bottom 0.406: v39.37,20.32 v39.37,12.7
DB8  (via drill 0.3)
  Top 0.406: v13.97,46.99 18.41,46.99 19.05,47.62 19.68,47.62 20.32,46.99 46.35,46.99 IC2.11
  Bottom 0.406: v13.97,46.99 13.34,46.35 13.34,39.37 14.61,38.1 TFT.13
DB9  (via drill 0.3)
  Top 0.406: v19.68,46.35 46.35,46.35 IC2.12
  Bottom 0.406: TFT.15 15.24,35.56 15.24,36.83 18.41,36.83 19.05,37.47 v19.05,38.73 19.05,45.72 v19.68,46.35
DB10  (via drill 0.3)
  Top 0.406: 15.24,33.02 TFT.17 | v20.95,42.55 24.13,45.72 46.35,45.72 IC2.13
  Bottom 0.406: TFT.17 15.24,33.02 15.24,34.29 18.41,34.29 19.05,34.92 19.05,35.56 20.32,36.83 20.32,41.91 v20.95,42.55
DB11  (via drill 0.3)
  Top 0.406: v47.62,44.45 46.99,44.45 IC2.15 | v40.64,36.83 34.92,31.11 v19.05,31.11
  Bottom 0.406: TFT.19 15.24,29.84 15.24,29.21 18.41,29.21 19.05,29.84 v19.05,31.11 | v47.62,44.45 40.64,37.47 v40.64,36.83
DB12  (via drill 0.3)
  Top 0.406: TFT.21 15.24,27.94 16.51,29.21 34.29,29.21 v40.64,35.56 | v48.26,43.18 IC2.17
  Bottom 0.406: 14.61,27.94 TFT.21 | v40.64,35.56 v48.26,43.18
DB13
  Top 0.406: TFT.23 15.24,24.77 15.88,24.13 17.78,24.13 18.41,23.5 28.57,23.5 30.48,21.59 80.01,21.59 80.01,27.3 79.38,27.3 IC3.18
  Bottom 0.406: 17.78,24.13 15.24,24.13 15.24,24.77 TFT.23
DB14
  Top 0.406: TFT.25 14.61,22.86 13.34,22.86 13.34,25.4 14.61,26.67 17.78,26.67 | 17.78,26.67 18.41,26.67 | IC3.17 76.83,26.67 74.3,29.21 66.67,29.21 62.87,25.4 22.86,25.4 22.23,26.04 20.32,26.04 19.68,25.4 19.05,25.4 17.78,26.67
DB15  (via drill 0.3)
  Top 0.406: v22.23,24.77 38.1,24.77 40.64,22.23 75.56,22.23 76.83,23.5 78.74,23.5 IC3.12
  Bottom 0.406: v22.23,24.77 20.95,26.04 20.95,26.67 19.68,27.94 19.05,27.94 19.05,27.3 18.41,26.67 13.34,26.67 13.34,21.59 14.61,20.32 TFT.27
GND  (via drill 0.3, 0.41, 0.6)
  Top 0.406: C13.1 50.97,69 51.31,69.34 51.31,72.9 U$7.GND@0 | PWR1.C v24.13,3.56 | 73.18,23.37 IC3.9 | IC3.9 IC3.10 | IC5.6 IC5.7 IC5.8 IC5.9 IC5.10 46.6,8.01 43.68,5.08 41.91,5.08 | IC4.1 80.69,13.29 v81.28,12.7 | v81.28,19.05 79.17,19.05 | 79.17,19.05 IC4.10 | 79.17,19.05 79.17,18.49 IC4.9 | IC2.19 41.94,41.88 v41.91,41.91 | IC2.1 52.45,41.02 52.07,40.64 | IC2.10 49.58,47.03 v49.53,46.99 | IC3.4 IC3.5 IC3.6 IC3.7 69.17,24.72 69.09,24.64 | IC4.19 68.61,13.94 v68.58,13.97 67.31,15.24 55.88,15.24 | v5.84,27.18 v5.84,28.45 | v5.84,28.45 v5.84,29.72 v5.84,30.99 5.84,31.75 | v5.84,28.45 7.53,28.45 R10.1 | 5.84,31.75 v5.84,32.26 v5.84,33.53 5.84,33.78 IC1.GND1 | IC1.GND 5.21,32.38 5.84,31.75 | IC1.GND1 6.6,34.29 v7.11,34.8 | v7.11,32.26 6.35,32.26 5.84,31.75 | IC1.GND1 v7.11,33.53 v5.84,34.8 v7.11,36.07 v5.84,36.07 v5.84,37.34 v5.84,38.61 | v5.84,38.61 v7.11,38.61 v7.11,37.34 | v5.84,38.61 v5.84,39.88 | v5.84,39.88 v4.57,39.88 v3.3,39.88 v3.3,41.15 v4.57,41.15 | v5.84,39.88 v5.84,41.15 v7.11,41.15 v7.11,39.88 | B_STP.C 67.09,76.42 v67.31,76.2 | R1.2 v35.81,59.69 | 55.88,15.24 47.2,15.24 IC5.1 IC5.2 | IC5.19 54.64,14 55.88,15.24 | v82.04,27.18 81.25,27.97 IC3.19 77.44,27.97 | IC3.9 69.25,23.46 69.09,23.62 | IC3.1 69.77,28.62 v69.09,27.94 | 54.29,36.51 56.13,38.35 v56.9,38.35 v60.71,38.35
  Top 0.61: A_STP.C 44.16,76.42 v44.2,76.45
  Top 0.813: U1.GND@1 41.91,2.54 | 41.91,2.54 U1.GND@0 | v36.83,7.11 39.88,7.11 41.91,5.08 41.91,2.54 | v31.75,4.57 v34.29,7.11 | C7.2 2.54,2.81 2.54,6.35 3.3,7.11 C12.- 4.06,8.89 v7.11,11.94 v7.11,14.48 v7.11,17.02 v7.11,19.56 8.13,19.56 10.16,21.59 10.16,23.91 D1.C 8.89,25.62 8.89,26.67 7.62,27.94 R10.1 | v11.43,41.91 R7.1 | C9.2 v7.62,44.45 7.62,45.72 9.53,47.63 C11.- 9.53,52.46 11.18,54.1 11.18,55.86 C10.1
  Top 1.016: v68.58,8.89 v81.28,8.89 | 77.44,27.97 74.93,30.48 v69.09,30.48 | 69.09,23.62 69.09,24.64 v69.09,27.94
  Top 1.422: v67.31,66.04 v64.77,66.04 | 52.07,40.64 52.07,37.47 53.34,37.47 54.29,36.51 60.33,30.48 v69.09,30.48 69.22,30.48
  Bottom 0.406: v35.81,59.69 35.81,59.18 | v60.71,40.89 v60.71,38.35 | v55.63,40.89 55.63,39.62 v56.9,38.35
  Bottom 0.61: v44.2,76.45 44.2,77.47
  Bottom 0.813: v34.29,7.11 v36.83,7.11 | v31.75,4.57 25.15,4.57 v24.13,3.56 22.86,4.83 v22.86,7.62 | v7.11,41.15 5.08,43.18 6.35,44.45 v7.62,44.45 8.89,44.45 v11.43,41.91
  Bottom 1.016: U1.GND@3 v81.28,8.89 v81.28,12.7 v81.28,19.05 82.04,19.81 v82.04,27.18 | v69.09,27.94 v69.09,30.48
  Bottom 1.27: v68.58,8.89 51.56,8.89 47.24,4.57 43.94,4.57 43.43,4.06 43.43,2.79 U1.GND@1 | U1.GND@4 U1.GND@3
  Bottom 1.422: U$7.GND v67.31,66.04
  other vias: 81.53,59.69 83.31,66.04 11.68,68.58 12.19,78.49 58.67,59.44 34.54,66.04 43.18,64.77 95.25,77.47 50.55,40.89 53.09,30.73 29.21,41.91 11.43,15.24 11.43,12.7 11.43,6.86 8.89,6.86 48.26,57.4 48.01,35.81 48.01,32 42.93,32
  pour Top (isolate 0.61, hatched): 100.33,82.55 100.33,0 16.51,0 16.51,50.8 -2.54,50.8 -2.54,82.55
  pour Bottom (isolate 0.305, hatched): -5.08,80.01 100.33,80.01 101.6,-3.81 16.51,-3.81 16.51,50.8 -5.08,50.8
  pour Top (isolate 0.406): -2.54,50.8 -2.54,-2.54 16.51,-2.54 16.51,50.8
  pour Bottom (isolate 0.406): -2.54,50.8 16.51,50.8 16.51,-3.81 -5.08,-3.81 -5.08,50.8
LED  (via drill 0.3)
  Top 0.406: v26.67,62.87 19.05,62.87 18.41,63.5 RN1.8
  Bottom 0.406: v26.67,62.87 27.94,61.59 27.94,51.44 28.57,50.8 U1.D13
N$1
  Top 0.406: U$6.SLP U$6.RST
N$2
  Top 0.406: RN1.4 14.61,68.58 PWR.A
N$3
  Top 0.406: R5.1 85.09,58.42 86.36,59.69 86.36,62.23 76.2,62.23 U$6.MS1 SJ1.2
N$4
  Top 1.422: A-MOT1.1 U$1.2B
  Bottom 1.422: A-MOT2.1 31.75,72.39 U$1.2B
N$5
  Top 1.422: A-MOT1.2 U$1.2A 34.29,71.12 A-MOT2.2
N$6
  Top 1.422: A-MOT1.3 U$1.1A 36.83,73.03 37.47,73.03 37.47,71.12 A-MOT2.3
N$7
  Top 1.422: A-MOT1.4 U$1.1B
  Bottom 0.406: 40.64,71.12 A-MOT2.4
  Bottom 1.422: 40.64,71.12 39.37,72.39 U$1.1B
N$8
  Top 0.406: U$1.SLP U$1.RST
N$9
  Top 0.406: SJ7.2 U$1.MS1 30.73,62.48 40.13,62.48 40.64,61.98 40.64,59.18 39.88,58.42 R1.1
N$10
  Top 0.406: U$6.MS2 SJ2.2
N$11
  Top 0.406: U$1.MS2 SJ8.2
N$12
  Top 0.406: U$6.MS3 SJ5.2
N$13
  Top 0.406: U$7.SLP U$7.RST
N$14
  Top 0.406: U$1.MS3 SJ9.2
N$15
  Top 0.406: RN1.2 17.14,73.66 RX_LED.C
N$16
  Top 0.406: RN1.3 15.88,67.31 16.51,67.94 16.51,71.12 TX_LED.C
N$17
  Top 0.406: U$7.MS2 SJ4.2
N$18
  Top 0.406: 66.04,78.74 B_STP.A 69.75,78.52 R11.1
N$19
  Top 0.406: A_STP.A 43.18,78.74 45.72,78.74 R6.1
N$20  (via drill 0.3)
  Top 0.406: v20.32,67.94 18.41,66.04 RN1.1 | v20.32,76.2 20.32,77.47 16.51,77.47 15.24,76.2 D13.A
  Bottom 0.406: v20.32,76.2 v20.32,67.94
N$21
  Bottom 1.422: C-MOT1.1 U$6.2B 77.47,72.39 C-MOT2.1
N$22
  Top 1.422: U$6.2A 80.01,71.12 C-MOT2.2
  Bottom 1.422: U$6.2A C-MOT1.2
N$23
  Top 0.406: C_STP.A 88.9,78.74 91.44,78.74 R3.1
N$24  (via drill 0.41)
  Top 0.406: 5.08,2.54 C7.1 | 8.89,8.89 C12.+ | ON_BOARD_PWR.2 7.62,1.02 8.13,0.76 10.92,0.76 11.94,1.52 13.46,1.52 14.22,2.29 19.81,2.29 22.1,4.57 R12.1
  Top 0.61: 9.7,9.19 C12.+ | 10.41,28.11 R9.2
  Top 0.813: 8.89,8.89 6.35,6.35 6.35,2.54 | ON_BOARD_PWR.2 6.35,2.54 | 6.35,2.54 C7.1 | 9.7,9.19 L1.2 11.31,17.91 v11.43,18.03 | v10.41,26.67 10.41,28.11
  Bottom 0.813: v11.43,18.03 11.43,25.65 v10.41,26.67
N$25
  Top 0.406: 28.89,2.64 PWR1.A
  Top 0.813: R12.2 28.89,2.64
N$26
  Bottom 0.406: 83.19,71.12 C-MOT2.3
  Bottom 1.422: C-MOT1.3 U$6.1A 82.55,71.75 83.19,71.12
N$27
  Bottom 1.422: C-MOT1.4 U$6.1B 85.09,72.39 86.36,71.12 C-MOT2.4
N$28
  Top 1.422: B-MOT1.1 U$7.2B
  Bottom 1.422: B-MOT2.1 54.61,72.39 U$7.2B
N$29
  Top 1.422: B-MOT1.2 U$7.2A 57.15,71.12 B-MOT2.2
N$30
  Top 1.422: B-MOT1.3 U$7.1A
  Bottom 0.406: 59.69,71.75 60.33,71.12
  Bottom 1.422: U$7.1A 59.69,71.75 | 60.33,71.12 B-MOT2.3
N$31
  Top 0.406: U$7.MS3 SJ6.2
N$32
  Top 0.61: 8.95,30.12 8.89,30.06
  Top 0.813: R10.2 8.89,30.06 R9.1 | IC1.FB 8.95,30.12
N$33
  Top 0.406: R8.1 62.23,58.42 63.5,59.69 63.5,62.23 53.34,62.23 U$7.MS1 SJ3.2
N$34  (via drill 0.3)
  Top 0.406: 3.81,44.45 R4.2
  Top 0.61: 3.81,44.45 5.71,42.55 v7.62,42.55 | IC1.EN 10.03,34.92 10.67,35.56 10.67,36.83 9.91,37.59 9.91,40.26 v9.53,40.64
  Bottom 0.61: v9.53,40.64 v7.62,42.55
N$36
  Top 1.422: B-MOT1.4 U$7.1B
  Bottom 1.422: U$7.1B 62.23,72.39 63.5,71.12 B-MOT2.4
N$37
  Top 0.406: 18.41,3.17 18.29,3.3 | 25.4,7.62 D2.A
  Top 0.813: 18.29,3.3 13.97,3.3 13.21,2.54 ON_BOARD_PWR.1 | 18.41,3.17 20.95,5.71 23.5,5.71 25.4,7.62
N$38
  Top 0.406: 10.79,44.45 C9.1
  Top 0.61: 10.79,44.45 10.79,43.56 8.13,40.89 8.13,38.1 8.89,37.34 8.89,36.26 IC1.SS
N$40  (via drill 0.41)
  Top 0.61: R7.2 11.43,38.35 11.68,37.85 v11.68,37.08 | C5.2 11.43,31.5 v11.68,30.48
  Bottom 0.61: v11.68,30.48 v11.68,37.08
N$42
  Top 0.61: IC1.COMP 11.06,33.66 C5.1
N$43  (via drill 0.41)
  Top 0.61: IC1.BS 3.75,37.53 v3.81,37.59 | v3.81,26.67 3.81,25.38 C8.1
  Bottom 0.61: v3.81,37.59 v3.81,26.67
N$44
  Top 0.61: C8.2 2.52,23.13 | 3.56,18.17 L1.1
  Top 0.813: IC1.SW 1.91,33.66 1.27,33.02 1.27,24.38 2.52,23.13 | D1.A 5.18,23.13 C8.2 3.56,18.17
RESET
  Top 0.406: S2.4 2.54,70.48 2.54,76.83 S2.3
  Bottom 0.406: S2.3 1.91,77.47 1.91,78.74 8.89,78.74 13.34,74.3 13.34,59.05 12.7,58.42 12.7,8.89 19.05,8.89 19.05,5.08 21.59,2.54 U1.RES
SERV1
  Bottom 0.406: SER1.3 19.05,77.47 24.77,77.47 27.94,74.3 27.94,69.6 30.48,67.06 30.48,59.05 38.73,50.8 U1.D9
SERV2
  Bottom 0.406: U1.D10 35.31,49.53 22.86,49.53 21.59,50.8 21.59,54.61 17.78,58.42 17.78,72.39 SER2.3
SPI_MISO  (via drill 0.3)
  Top 0.406: v88.27,11.43 59.18,11.43 58.93,11.18 57.66,11.18 57.4,11.43 52.7,11.43 IC5.15
  Bottom 0.406: U1.D50 89.53,12.7 v88.27,11.43
SPI_MISO_TFT  (via drill 0.3)
  Top 0.406: v35.56,11.43 43.18,11.43 43.81,12.06 46.35,12.06 IC5.5 | v29.84,17.14 17.78,17.14 TFT.30
  Bottom 0.406: 17.78,17.14 TFT.30 | v29.84,17.14 v35.56,11.43
SPI_MOSI
  Top 0.406: U1.D51 95.25,13.97 92.08,13.97 89.53,16.51 79.38,16.51 IC4.6
SPI_MOSI_TFT  (via drill 0.3)
  Top 0.406: v31.11,18.41 32.38,17.14 73.03,17.14 IC4.14 | v25.4,14.61 23.5,12.7 17.78,12.7 TFT.34
  Bottom 0.406: v31.11,18.41 25.4,18.41 v25.4,14.61
SPI_SCK
  Top 0.406: IC4.4 88.27,15.24 93.34,10.16 U1.D52
SPI_SCK_TFT
  Top 0.406: TFT.32 18.29,15.11 20.83,15.11 21.59,15.88 73.03,15.88 IC4.16
SPI_SS
  Top 0.406: U1.D53 95.25,11.43 93.34,11.43 88.9,15.88 79.38,15.88 IC4.5
SPI_SS_TFT  (via drill 0.3)
  Top 0.406: v22.86,18.41 29.84,18.41 31.75,16.51 73.03,16.51 IC4.15
  Bottom 0.406: 17.78,9.53 TFT.36 17.78,10.16 19.05,10.16 19.68,10.79 19.68,15.24 v22.86,18.41
TFT_CS  (via drill 0.3)
  Top 0.406: v74.3,15.24 IC4.17 | v19.68,26.67 v62.87,26.67
  Bottom 0.406: TFT.29 16.51,19.05 18.41,19.05 19.05,19.68 19.05,26.04 v19.68,26.67 | v62.87,26.67 v74.3,15.24
TFT_LEDA
  Top 0.406: TFT.37 15.24,7.62 16.51,8.89 18.41,8.89 20.07,10.54 25.78,10.54 26.67,11.43 R26.2
TFT_RD
  Top 0.406: TFT.11 14.61,40.01 12.7,40.01 12.7,7.62 13.97,6.35 19.05,6.35 22.1,9.4 29.72,9.4 31.75,11.43 R13.2
TFT_REST  (via drill 0.3)
  Top 0.406: v21.59,18.41 22.86,19.68 31.11,19.68 33.02,17.78 73.03,17.78 IC4.13
  Bottom 0.406: TFT.33 15.24,12.7 15.24,13.97 18.41,13.97 19.05,14.61 19.05,15.88 v21.59,18.41
TFT_RS  (via drill 0.3)
  Top 0.406: v71.75,14.61 73.03,14.61 IC4.18 | v59.69,27.94 49.53,38.1 21.59,38.1 17.78,41.91 13.97,41.91 13.34,42.55 13.34,45.09 14.61,45.09 TFT.7
  Bottom 0.406: 18.41,44.45 15.24,44.45 15.24,45.09 TFT.7 15.24,45.72 15.24,46.99 | v71.75,14.61 59.69,26.67 v59.69,27.94
TFT_WR  (via drill 0.3)
  Top 0.406: v42.55,18.8 42.93,18.41 73.03,18.41 IC4.12 | v39.37,39.37 22.86,39.37 17.78,44.45 16.51,44.45 15.24,43.18 TFT.9
  Bottom 0.406: 15.24,41.91 15.24,42.55 TFT.9 | v42.55,18.8 42.55,22.23 39.37,25.4 v39.37,39.37
VCC  (via drill 0.6)
  Top 0.406: 13.34,71.12 13.97,71.12 13.97,67.31 13.72,67.06 13.72,65.02 14.61,64.14 RN1.5 14.61,63.5 | 13.34,71.12 13.34,73.66 RX_LED.A 12.7,73.66 13.97,74.93 21.59,74.93 | 13.34,71.12 TX_LED.A | 69.6,64.26 R19.1 69.85,64.14 70.48,64.14 | 34.29,57.78 SJ9.1 | 92.71,64.14 R18.1 | 31.81,57.97 SJ8.1 | SJ6.1 57.15,56.9 | SJ4.1 54.61,56.9 | SJ2.1 77.47,56.9 | SJ5.1 80.01,56.9 | SJ1.1 74.93,56.9 | 30.48,7.62 D2.C | 52.7,14.61 IC5.20 50.09,14.48 50.04,14.48 49.53,13.97
  Top 0.61: SJ3.1 52.07,56.9 | 92.78,64.52 R18.1 | SJ8.1 31.75,56.64 | SJ9.1 34.29,56.64 | 49.53,13.97 49.53,5.33 49.78,5.08
  Top 0.813: 69.6,64.26 52.07,64.26 51.31,63.5 49.53,63.5 48.77,62.74 47.18,62.74 R2.1 46.99,59.69 | 46.99,59.69 48.26,59.69 50.8,56.9 52.07,56.9 54.61,56.9 57.15,56.9 74.93,56.9 77.47,56.9 80.01,56.9 88.65,56.9 88.9,57.15 97.79,57.15 | 38.1,1.02 31.5,1.02 30.61,1.91 30.48,1.91 30.48,7.62 | 38.1,1.02 47.5,1.02 48.26,1.78 48.26,3.56 49.78,5.08 v99.06,5.08 | JP15.5 98.3,71.88 98.3,64.77 97.79,64.26 97.79,64.01 | 92.78,64.52 97.28,64.52 97.79,64.01 | U$6.VDD 87.63,74.68 87.12,75.18 87.12,77.22 85.85,78.49 76.2,78.49 75.18,77.47 75.18,75.44 74.93,75.18 66.29,75.18 U$7.VDD 64.01,74.42 64.01,77.22 62.74,78.49 49.28,78.49 48.77,77.98 48.77,75.95 47.75,74.93 42.42,74.93 41.91,74.42 U$1.VDD 41.66,73.91 41.66,77.47 40.64,78.49 22.61,78.49 21.59,77.47 SER1.2 21.59,74.93 SER2.2 | U1.5V@1 U1.5V@2 97.79,52.07 97.79,57.15 | 97.79,64.01 97.79,57.15 | 46.99,59.69 43.94,59.69 40.89,56.64 34.29,56.64 31.75,56.64 29.46,56.64 | 29.46,56.64 29.21,56.9 SJ7.1 | TFT.3 14.84,50.69 12.7,52.83 12.7,54.86 14.48,56.64 29.46,56.64 | 38.1,1.27 38.1,1.02
  Top 1.27: U1.5V@0 38.1,1.27
  Bottom 0.61: U$6.VDD 87.63,75.18
  Bottom 0.813: JP15.5 95,75.18 87.63,75.18 | v99.06,5.08 99.06,48.26 U1.5V@2
VIN
  Bottom 0.61: EXT_PWR.1 4.45,74.93 4.45,69.22 1.27,66.04 1.27,7.62 3.81,5.08 11.43,5.08 15.24,1.02 44.2,1.02 U1.VIN
X-MAX  (via drill 0.3)
  Top 0.406: U1.D17 78.74,53.34 v93.34,53.34
  Bottom 0.406: v93.34,53.34 97.79,57.78 97.79,69.85 JP15.3
X-MIN  (via drill 0.3)
  Top 0.406: U1.D16 77.47,54.61 v93.34,54.61
  Bottom 0.406: v93.34,54.61 96.52,57.78 JP15.1
Y-MAX
  Bottom 0.406: U1.D15 71.12,61.72 77.98,68.58 89.92,68.58 92.46,71.12 JP15.4
Y-MIN  (via drill 0.3)
  Top 0.406: U1.D14 73.66,55.88 v93.34,55.88
  Bottom 0.406: v93.34,55.88 93.98,56.52 JP15.2

### Text on the board
tValues: C1 | C4 | 100uF | 100uF | 10k | 10k | 10k | R2 | R19 | R18 | R1 | R8 | 1k | 1k | 1k | 3v3 | 3v3 | 3v3 | 5v
_tsilk: + | + | + | + | Polarshield v2.0c / www.polargraph.co.uk / 2014.06.07 | MS 1 2 3 | MS 1 2 3 | MS 1 2 3 | 1 | Polarshield v2.0c / An open source art project. / www.polargraph.co.uk / 2014.06.07 | 10 | 10 | + | +
_bsilk: servo | S1 | GND | limits | +V | S2 | S | - | X+ | Y+ | + | X- | Y+ | MOTOR A | MOTOR B | MOTOR C | Polarshield v2.0c | www.polargraph.co.uk